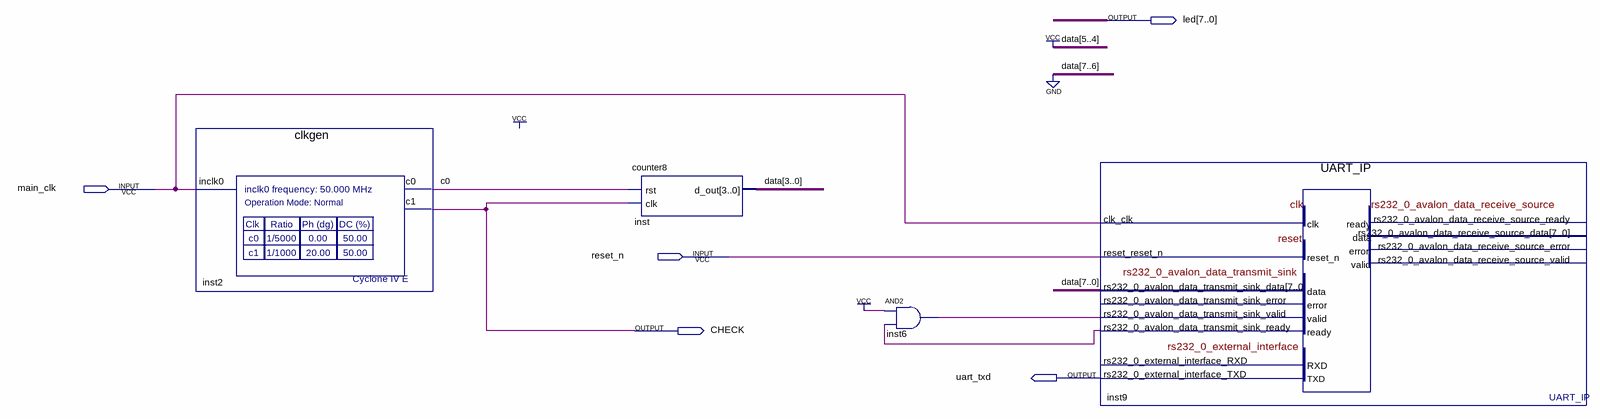
[diagram p0: schematic sheet]
// Quartus schematic SEU_ROY.bdf as structural Verilog: 4 symbols, 5 pins
module SEU_ROY (
  input  main_clk,
  input  reset_n,
  output [7:0] led,
  output CHECK,
  output uart_txd
);

  wire c0, inst6_out, inst9_rs232_0_avalon_data_transmit_sink_ready;
  wire [3:0] data;

  clkgen inst2 (.inclk0(main_clk), .c0(c0), .c1(CHECK));
  counter8 inst (.rst(c0), .clk(CHECK), .d_out(data));
  and inst6 (inst6_out, 1'b1, inst9_rs232_0_avalon_data_transmit_sink_ready);
  UART_IP inst9 (
    .clk_clk(main_clk), .reset_reset_n(reset_n), .rs232_0_avalon_data_transmit_sink_data({4'b0011, data}),
    .rs232_0_avalon_data_transmit_sink_valid(inst6_out),
    .rs232_0_avalon_data_transmit_sink_ready(inst9_rs232_0_avalon_data_transmit_sink_ready),
    .rs232_0_external_interface_TXD(uart_txd));  // open: rs232_0_avalon_data_receive_source_ready, rs232_0_avalon_data_transmit_sink_error, rs232_0_external_interface_RXD, rs232_0_avalon_data_receive_source_data, rs232_0_avalon_data_receive_source_error, rs232_0_avalon_data_receive_source_valid
endmodule
